# EAGLE design LM339 (EAGLE 9.6.2)
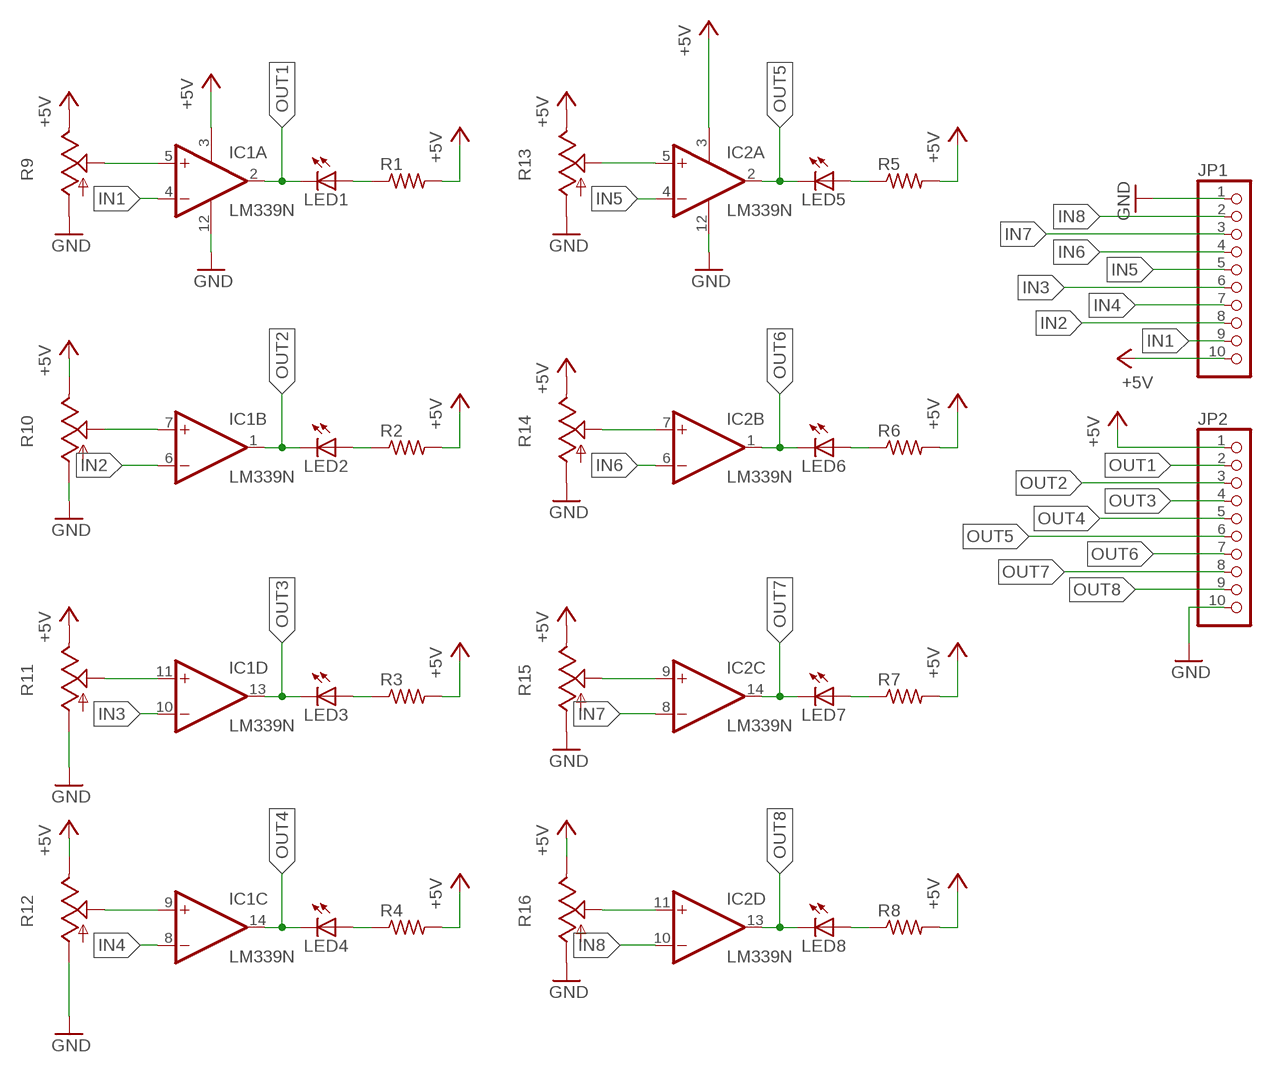
[diagram p0: schematic, sheet 1]

## Parts
IC1  LM339N  [DIL14]
IC2  LM339N  [DIL14]
JP1  PINHD-1X10  [1X10]
JP2  PINHD-1X10  [1X10]
LED1  LED5MM  [LED5MM]
LED2  LED5MM  [LED5MM]
LED3  LED5MM  [LED5MM]
LED4  LED5MM  [LED5MM]
LED5  LED5MM  [LED5MM]
LED6  LED5MM  [LED5MM]
LED7  LED5MM  [LED5MM]
LED8  LED5MM  [LED5MM]
R1  R-US_0204/7  [0204/7]
R2  R-US_0204/7  [0204/7]
R3  R-US_0204/7  [0204/7]
R4  R-US_0204/7  [0204/7]
R5  R-US_0204/7  [0204/7]
R6  R-US_0204/7  [0204/7]
R7  R-US_0204/7  [0204/7]
R8  R-US_0204/7  [0204/7]
R9  TRIM_US-B25P  [B25P]
R10  TRIM_US-B25P  [B25P]
R11  TRIM_US-B25P  [B25P]
R12  TRIM_US-B25P  [B25P]
R13  TRIM_US-B25P  [B25P]
R14  TRIM_US-B25P  [B25P]
R15  TRIM_US-B25P  [B25P]
R16  TRIM_US-B25P  [B25P]

## Nets
+5V: IC1.3(P:V+) IC2.3(P:V+) JP1.10 JP2.1 R1.2 R2.2 R3.2 R4.2 R5.2 R6.2 R7.2 R8.2 R9.E R10.E R11.E R12.E R13.E R14.E R15.E R16.E
GND: IC1.12(P:GND) IC2.12(P:GND) JP1.1 JP2.10 R9.A R10.A R11.A R12.A R13.A R14.A R15.A R16.A
IN1: IC1.4(A:-IN) JP1.9
IN2: IC1.6(B:-IN) JP1.8
IN3: IC1.10(D:-IN) JP1.6
IN4: IC1.8(C:-IN) JP1.7
IN5: IC2.4(A:-IN) JP1.5
IN6: IC2.6(B:-IN) JP1.4
IN7: IC2.8(C:-IN) JP1.3
IN8: IC2.10(D:-IN) JP1.2
N$1: LED2.A R2.1
N$2: LED1.A R1.1
N$3: LED3.A R3.1
N$4: LED4.A R4.1
N$5: LED5.A R5.1
N$6: LED6.A R6.1
N$7: LED7.A R7.1
N$8: LED8.A R8.1
N$9: IC1.11(D:+IN) R11.S
N$10: IC1.5(A:+IN) R9.S
N$11: IC1.7(B:+IN) R10.S
N$12: IC1.9(C:+IN) R12.S
N$13: IC2.9(C:+IN) R15.S
N$14: IC2.5(A:+IN) R13.S
N$15: IC2.7(B:+IN) R14.S
N$24: IC2.11(D:+IN) R16.S
OUT1: IC1.2(A:OUT) JP2.2 LED1.K(C)
OUT2: IC1.1(B:OUT) JP2.3 LED2.K(C)
OUT3: IC1.13(D:OUT) JP2.4 LED3.K(C)
OUT4: IC1.14(C:OUT) JP2.5 LED4.K(C)
OUT5: IC2.2(A:OUT) JP2.6 LED5.K(C)
OUT6: IC2.1(B:OUT) JP2.7 LED6.K(C)
OUT7: IC2.14(C:OUT) JP2.8 LED7.K(C)
OUT8: IC2.13(D:OUT) JP2.9 LED8.K(C)

## Library data of the parts
IC1 IC2 = linear:LM339: Low Power Low Offset Voltage Quad Comparators with open collector; LM139/LM239/LM339/LM2901/LM3302
JP1 JP2 = pinhead:PINHD-1X10: PIN HEADER
LED1-LED8 = led:LED: LED OSRAM: - CHIPLED LG R971, LG N971, LY N971, LG Q971, LY Q971, LO R971, LY R971 LH N974, LH R974 LS Q976, LO Q976, LY Q976 LO Q996 - Hyper CHIPLED LW Q18S LB Q993, LB Q99A, LB R99A - SideLED LS A670, LO A670, LY A670, LG A670, LP A670 LB A673, LV A673, LT A673, LW A673 LH A674 LY A675 LS A676, LA A676, LO A676, LY A676, LW A676 LS A679, LY A679, LG A679 - Hyper Micro SIDELED® LS Y876, LA Y876, LO Y876, LY Y876 LT Y87S - SmartLED LW L88C, LW L88S LB L89C, LB L89S, LG L890 LS L89K, LO L89K, LY L89K LS L896, LA L896, LO L896, LY L896 - TOPLED LS T670, LO T670, LY T670, LG T670, LP T670 LSG T670, LSP T670, LSY T670, LOP T670, LYG T670 LG T671, LOG T671, LSG T671 LB T673, LV T673, LT T673, LW T673 LH T674 LS T676, LA T676, LO T676, LY T676, LB T676, LH T676, LSB T676, LW T676 LB T67C, LV T67C, LT T67C, LS T67K, LO T67K, LY T67K, LW E67C LS E67B, LA E67B, LO E67B, LY E67B, LB E67C, LV E67C, LT E67C LW T67C LS T679, LY T679, LG T679 LS T770, LO T770, LY T770, LG T770, LP T770 LB T773, LV T773, LT T773, LW T773 LH T774 LS E675, LA E675, LY E675, LS T675 LS T776, LA T776, LO T776, LY T776, LB T776 LHGB T686 LT T68C, LB T68C - Hyper Mini TOPLED® LB M676 - Mini TOPLED Santana® LG M470 LS M47K, LO M47K, LY M47K Source: http://www.osram.convergy.de LUXEON: - LUMILED® LXK2-PW12-R00, LXK2-PW12-S00, LXK2-PW14-U00, LXK2-PW14-V00 LXK2-PM12-R00, LXK2-PM12-S00, LXK2-PM14-U00 LXK2-PE12-Q00, LXK2-PE12-R00, LXK2-PE12-S00, LXK2-PE14-T00, LXK2-PE14-U00 LXK2-PB12-K00, LXK2-PB12-L00, LXK2-PB12-M00, LXK2-PB14-N00, LXK2-PB14-P00, LXK2-PB14-Q00 LXK2-PR12-L00, LXK2-PR12-M00, LXK2-PR14-Q00, LXK2-PR14-R00 LXK2-PD12-Q00, LXK2-PD12-R00, LXK2-PD12-S00 LXK2-PH12-R00, LXK2-PH12-S00 LXK2-PL12-P00, LXK2-PL12-Q00, LXK2-PL12-R00 Source: www.luxeon.com KINGBRIGHT: KA-3528ASYC Source: www.kingbright.com
R1-R8 = rcl:R-US_: RESISTOR, American symbol; SPICEPREFIX: R
R9-R16 = pot:TRIM_US-: POTENTIOMETER

## Board
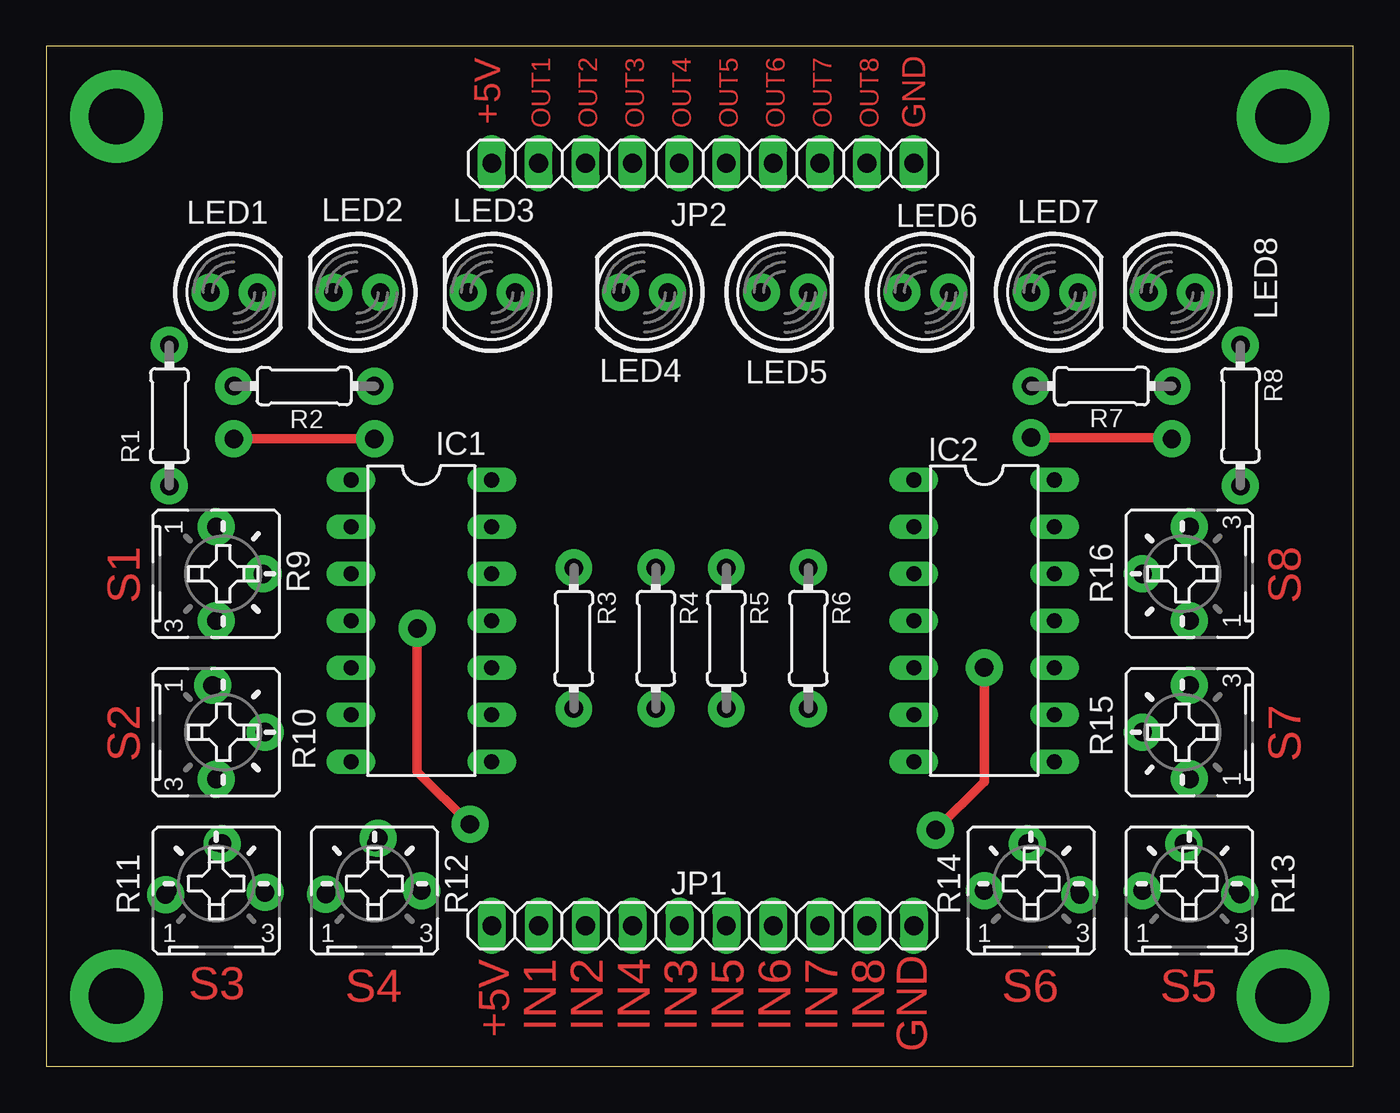
[diagram p1: board, top side]
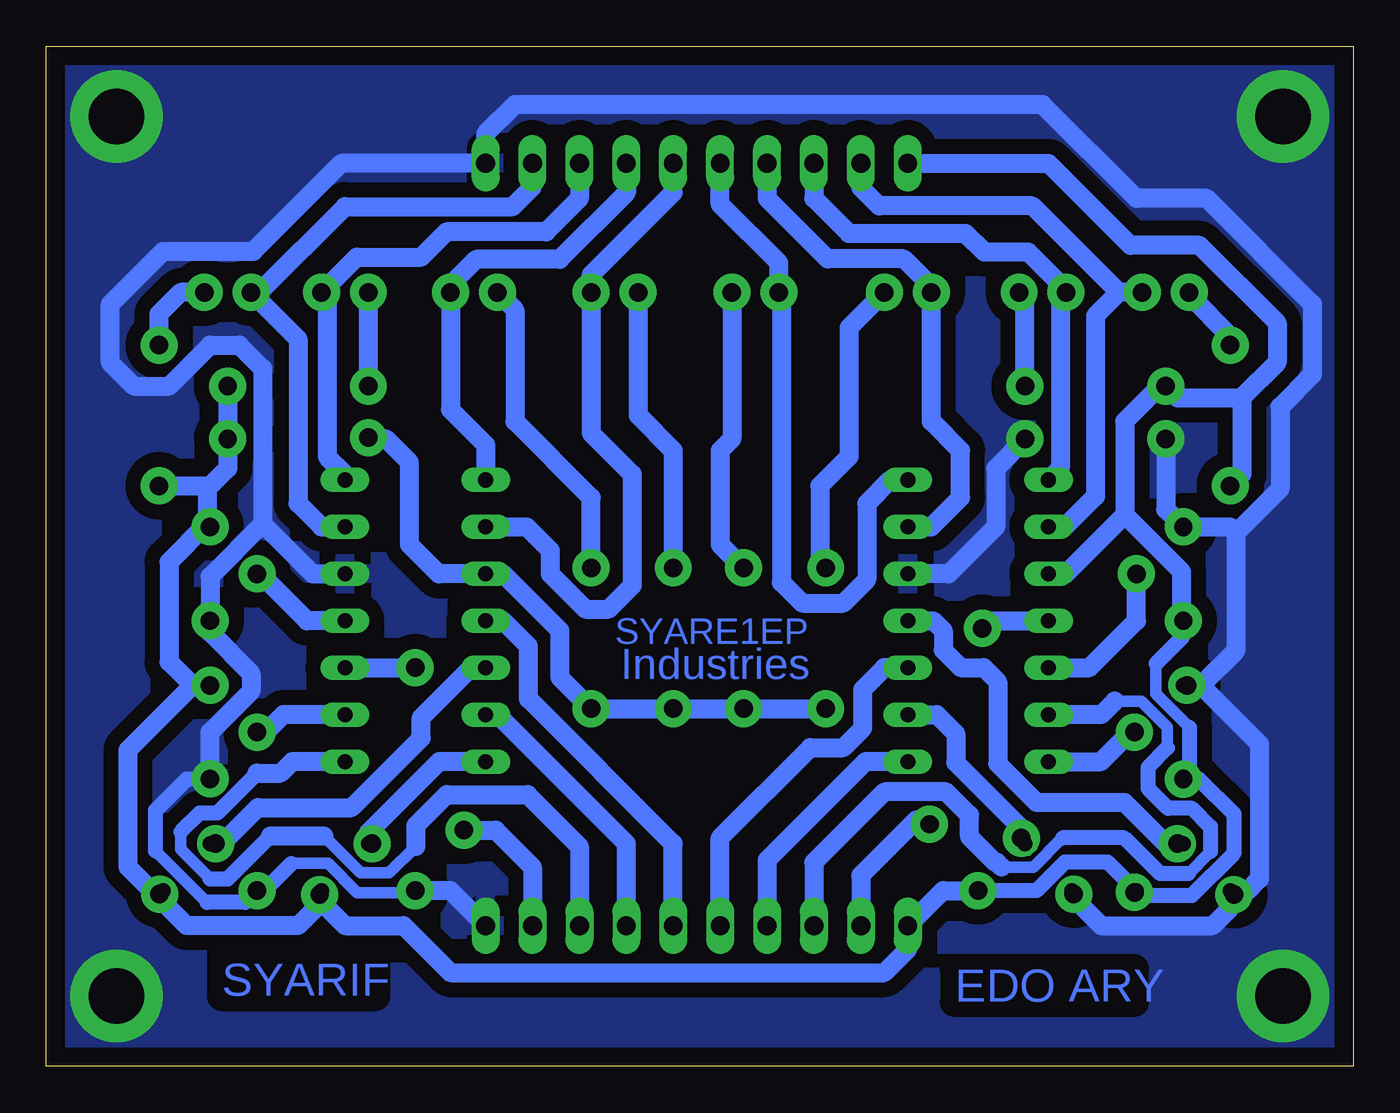
[diagram p2: board, bottom side, seen from below]

Size 70.79 x 55.23 mm. Coordinates in mm from the lower left corner, seen from the top.
Outline: 0,0 70.79,0 70.79,55.23 0,55.23 0,0
Copper layers (1*16): Top 0.035mm / dielectric 1.5mm / Bottom 0.035mm
Design rules "default": minimum track width 6mil, minimum drill 0.35mm, track to track 6mil, track to pad 6mil, pad to pad 6mil, via to via 6mil, smd to smd 6mil, copper to edge 40mil, drill to drill 6mil, minimum pad ring 10mil, minimum via ring 8mil, stop-mask expansion 4mil, vias tented up to drill 0mil, thermal gap 10mil

### Footprints (pad centres in the part's own frame; a part is rotated, then mirrored left to right if it is on the bottom)
DIL14 = drill 0.813 long: 1 -7.62,-3.81; 2 -5.08,-3.81; 3 -2.54,-3.81; 4 0,-3.81; 5 2.54,-3.81; 6 5.08,-3.81; 7 7.62,-3.81; 8 7.62,3.81; 9 5.08,3.81; 10 2.54,3.81; 11 0,3.81; 12 -2.54,3.81; 13 -5.08,3.81; 14 -7.62,3.81
1X10 = drill 1.016 long: 1 -11.43,0; 2 -8.89,0; 3 -6.35,0; 4 -3.81,0; 5 -1.27,0; 6 1.27,0; 7 3.81,0; 8 6.35,0; 9 8.89,0; 10 11.43,0
LED5MM = drill 0.813 octagon: A -1.27,0; K 1.27,0
0204/7 = drill 0.813 octagon: 1 -3.81,0; 2 3.81,0
B25P = drill 0.813 octagon: A -2.54,0; E 2.54,0; S 0,2.54

### Placement (x,y rotation side)
IC1  20.32,24.13 270 top
IC2  50.8,24.13 270 top
JP1  35.56,7.62 180 top
JP2  35.56,48.9 0 top
LED1  10.16,41.91 0 top
LED2  16.83,41.91 180 top
LED3  24.13,41.91 180 top
LED4  32.38,41.91 180 top
LED5  40.01,41.91 0 top
LED6  47.62,41.91 0 top
LED7  54.61,41.91 0 top
LED8  60.96,41.91 180 top
R1  6.67,35.24 270 top
R2  13.97,36.83 180 top
R3  28.57,23.18 270 top
R4  33.02,23.18 270 top
R5  36.83,23.18 270 top
R6  41.27,23.18 270 top
R7  57.15,36.83 0 top
R8  64.67,35.24 270 top
R9  9.21,26.67 270 top
R10  9.21,18.1 270 top
R11  9.21,9.53 0 top
R12  17.78,9.53 0 top
R13  61.91,9.53 0 top
R14  53.34,9.53 0 top
R15  61.91,18.1 90 top
R16  61.91,26.67 90 top

### Tracks (layer width: path | path; a pad name or v marks a point on that pad's centre or on a via)
+5V  (via drill 1 pad 2)
  Top 0.508: v53.34,34.04 60.89,34.04 v60.96,33.97
  Bottom 0.61: 8.88,18.36 10.69,20.18 10.69,21.81
  Bottom 0.813: R12.E 17.16,9.53 15.63,11.06 13.3,11.06 11.76,9.53 R11.E 11.49,9.26 8.74,9.26 6.46,11.55 6.46,13.66 8.36,15.56 R10.E 8.88,15.89 8.88,18.36 | R9.E 9.21,23.3 10.69,21.81
  Bottom 1.016: 15.88,26.67 IC1.3 15.57,26.67 12.38,29.86 | JP2.1 16.51,48.9 12.06,44.45 8.33,44.45 4.13,40.25 4.13,38.1 6.03,36.2 | 46.67,26.67 IC2.3 | R3.2 R4.2 R5.2 R6.2 42.98,21.07 42.98,23.61 46.04,26.67 IC2.3 | IC2.3 49.53,26.67 51.12,28.26 51.12,32.7 52.39,33.97 53.27,33.97 v53.34,34.04 | R7.2 v60.96,33.97 60.96,32.38 62.07,31.27 | 62.07,29.37 64.14,27.3 64.14,21.91 62.87,20.64 | 62.87,20.64 R15.E | 62.87,20.64 66.36,17.14 66.36,10.79 65.09,9.53 R13.E 64.45,8.89 63.18,7.62 57.15,7.62 55.88,8.89 | R8.2 62.07,31.43 62.07,31.27 | R12.E 22.23,9.53 JP1.10 24.13,6.35 25.4,5.08 48.9,5.08 51.44,7.62 54.61,7.62 55.88,8.89 | R9.E 9.29,24.21 9.29,26.77 12.38,29.86 | R14.E 55.88,8.89 | 12.38,29.86 12.38,34.92 10.48,36.83 R2.2 9.53,36.2 6.03,36.2 | 6.03,36.2 6.03,32.07 R1.2 | 62.07,31.27 62.07,29.37 | 62.07,29.37 R16.E
GND  (via drill 1 pad 2, 3 pad 5)
  Top 0.508: v10.16,33.97 v17.78,33.97
  Bottom 0.61: 62.09,8.89 64.86,11.66 | 50.92,9.41 53.94,9.41 55.53,11 57.5,11
  Bottom 0.813: R14.A 50.92,9.41 | R15.A 63.18,15.56 64.86,13.88 64.86,11.66 | 62.09,8.89 60.01,8.89 R13.A 58.97,9.53 57.5,11
  Bottom 1.016: 55.24,26.67 IC2.12 56.35,26.67 59.05,29.38 | v17.78,33.97 19.37,32.38 19.37,29.21 21.91,26.67 IC1.12 | 59.05,29.38 59.05,37.78 60.33,39.05 61.91,39.05 64.14,36.83 66.04,36.83 67.31,38.1 67.31,41.27 64.45,44.13 59.58,44.13 54.81,48.9 JP2.10 46.99,50.48 45.4,52.07 16.83,52.07 11.75,46.99 7.94,46.99 2.22,41.27 2.22,37.47 3.97,35.72 3.97,31.27 6.35,28.89 | 59.05,29.38 61.91,26.52 R16.A 61.91,23.5 59.69,21.27 59.69,20.32 61.91,18.1 v61.91,15.57 R15.A | JP1.1 48.9,9.53 R14.A | R12.A 15.24,9.21 13.65,7.62 7.62,7.62 6.67,8.57 R11.A 5.71,9.53 5.08,10.16 5.08,17.46 8.26,20.64 | 8.26,20.64 R10.A | 8.26,20.64 6.35,22.54 6.35,28.89 | v10.16,33.97 10.16,30.16 R9.A 6.67,29.21 6.35,28.89
  other vias: 3.81,51.44 66.99,51.44 66.99,3.81 3.81,3.81
  pour Bottom (isolate 0.813): -8.89,57.95 74.3,57.95 74.3,-3.81 -8.89,-3.81
IN1  (via drill 1 pad 2)
  Top 0.508: v22.95,13.11 20.1,15.97 v20.1,23.72
  Bottom 1.016: v22.95,13.11 22.73,13.34 23.68,13.34 26.67,10.35 JP1.9 | v20.1,23.72 19.68,24.13 IC1.4
IN2
  Bottom 0.61: 15.75,12.38 17.34,10.79 19.05,10.79 | 10.06,17.25 10.06,18.37 11.47,19.79 12.92,19.79 | 7.74,11.63 8.92,10.45
  Bottom 0.813: 8.92,10.45 10.46,10.45 12.4,12.38 15.75,12.38 | 7.74,11.63 7.74,12.98 8.72,13.97 10.04,13.97 11.11,15.04 11.11,16.19 10.06,17.25
  Bottom 1.016: 19.05,10.79 19.33,11.07 19.43,11.07 20.79,12.44 20.79,13.61 22.06,14.87 25.39,14.87 29.21,11.05 JP1.8 | 12.92,19.79 13.65,19.05 IC1.6
IN3
  Bottom 1.016: 24.39,21.59 IC1.10 25.4,21.59 26.57,20.42 26.57,18.32 27.62,17.26 29.41,17.26 34.29,12.38 JP1.6
IN4
  Bottom 1.016: IC1.8 26.41,16.51 31.75,11.17 JP1.7
IN5
  Bottom 1.016: JP1.5 36.83,12.06 44.67,19.9 44.67,22.76 46.04,24.13 IC2.4
IN6
  Bottom 1.016: 39.37,6.99 JP1.4 39.37,12.06 46.35,19.05 IC2.6
IN7
  Bottom 0.61: 55.74,12.46 53.76,10.48 52.2,10.48 50.78,11.91 | 63.5,12.7 63.5,11.75 61.91,10.16
  Bottom 0.813: 61.91,10.16 60.96,10.16 58.66,12.46 | 59.37,15.88 61.53,13.72 62.48,13.72 63.5,12.7
  Bottom 1.016: IC2.8 57.47,16.51 58.1,15.88 59.37,15.88 | 50.78,11.91 50.78,13.04 49.1,14.71 44.72,14.71 41.91,11.91 JP1.3 | 55.74,12.46 58.66,12.46
IN8  (via drill 1 pad 2)
  Top 0.508: v48.17,12.8 50.8,15.43 v50.8,21.59
  Bottom 1.016: 55.24,21.59 IC2.10 v50.8,21.59 | v48.17,12.8 46.45,12.8 44.45,10.79 JP1.2
N$1
  Bottom 1.016: R2.1 17.78,41.59 LED2.A
N$2
  Bottom 1.016: LED1.A 8.89,41.74 6.67,39.52 R1.1
N$3
  Bottom 1.016: LED3.A 27.3,40.01 27.3,33.02 28.89,31.43 28.89,27.3 R3.1
N$4
  Bottom 1.016: LED4.A 33.66,33.97 34.29,33.34 34.29,28.26 R4.1
N$5
  Bottom 1.016: LED5.A 38.73,35.24 36.83,33.34 R5.1
N$6
  Bottom 1.016: R6.1 41.27,30.8 45.4,34.92 45.4,40.96 LED6.A
N$7
  Bottom 1.016: R7.1 LED7.A
N$8
  Bottom 1.016: R8.1 64.67,40.74 63.5,41.91 LED8.A
N$9
  Bottom 1.016: IC1.11 22.74,24.13 22.21,23.59 22.21,22.54 21.25,21.59 20.02,21.59 19.25,20.82 19.25,16.39 17.14,14.29 12.38,14.29 10.16,12.06 R11.S
N$10  (via drill 1 pad 2)
  Bottom 1.016: IC1.5 14.29,21.59 11.75,24.13 R9.S
  other vias: 11.75,26.67
N$11
  Bottom 1.016: IC1.7 13.67,16.51 12.08,18.1 R10.S
N$12
  Bottom 1.016: 23.81,19.05 IC1.9 22.56,19.05 21.53,18.02 21.53,16.45 17.78,12.7 R12.S
N$13
  Bottom 1.016: IC2.9 57.94,19.05 58.9,18.1 R15.S
N$14
  Bottom 1.016: IC2.5 47.78,21.59 50.48,18.89 50.48,17.78 54.25,14.01 59.33,14.01 61.28,12.06 R13.S
N$15
  Bottom 1.016: IC2.7 49.5,16.51 53.34,12.67 R14.S
N$16  (via drill 1 pad 2)
  other vias: 6.67,39.05
N$17  (via drill 1 pad 2)
  other vias: 10.16,36.83
N$18  (via drill 1 pad 2)
  other vias: 11.43,41.91
N$19  (via drill 1 pad 2)
  other vias: 15.56,41.91
N$20  (via drill 1 pad 2)
  other vias: 25.4,41.91
N$21  (via drill 1 pad 2)
  other vias: 31.11,41.91
N$22  (via drill 1 pad 2)
  other vias: 41.27,26.99
N$23  (via drill 1 pad 2)
  other vias: 33.66,41.91
N$24
  Bottom 1.016: IC2.11 56.66,24.13 59.2,26.67 R16.S
N$25  (via drill 1 pad 2)
  other vias: 38.73,41.91
N$26  (via drill 1 pad 2)
  other vias: 41.27,41.91
N$27  (via drill 1 pad 2)
  other vias: 17.78,36.83
N$28  (via drill 1 pad 2)
  other vias: 48.9,41.91
N$29  (via drill 1 pad 2)
  other vias: 53.34,41.91
N$30  (via drill 1 pad 2)
  other vias: 55.88,41.91
N$31  (via drill 1 pad 2)
  other vias: 53.34,36.83
N$32  (via drill 1 pad 2)
  other vias: 60.96,36.83
N$33  (via drill 1 pad 2)
  other vias: 64.67,31.43
N$34  (via drill 1 pad 2)
  other vias: 62.23,41.91
N$35  (via drill 1 pad 2)
  other vias: 64.67,39.05
N$36  (via drill 1 pad 2)
  other vias: 59.69,41.91
N$37  (via drill 1 pad 2)
  other vias: 8.89,41.91
N$38  (via drill 1 pad 2)
  other vias: 33.02,19.37
N$39  (via drill 1 pad 2)
  other vias: 36.83,19.37
N$40  (via drill 1 pad 2)
  other vias: 41.27,19.37
N$41  (via drill 1 pad 2)
  other vias: 18.1,41.91
N$42  (via drill 1 pad 2)
  other vias: 22.86,41.91
N$43  (via drill 1 pad 2)
  other vias: 46.35,41.91
N$44  (via drill 1 pad 2)
  other vias: 59.37,26.67
N$45  (via drill 1 pad 2)
  other vias: 61.91,29.21
N$46  (via drill 1 pad 2)
  other vias: 61.91,24.13
N$47  (via drill 1 pad 2)
  other vias: 61.91,20.64
N$48  (via drill 1 pad 2)
  other vias: 59.37,18.1
N$49  (via drill 1 pad 2)
  other vias: 61.61,12.06
N$50  (via drill 1 pad 2)
  other vias: 59.37,9.53
N$51  (via drill 1 pad 2)
  other vias: 64.65,9.32
N$52  (via drill 1 pad 2)
  other vias: 55.98,9.31
N$53  (via drill 1 pad 2)
  other vias: 53.14,12.06
N$54  (via drill 1 pad 2)
  other vias: 50.8,9.53
N$55  (via drill 1 pad 2)
  other vias: 20.32,9.53
N$56  (via drill 1 pad 2)
  other vias: 17.98,12.37
N$57  (via drill 1 pad 2)
  other vias: 15.14,9.32
N$58  (via drill 1 pad 2)
  other vias: 11.85,9.43
N$59  (via drill 1 pad 2)
  other vias: 9.53,12.06
N$60  (via drill 1 pad 2)
  other vias: 6.47,9.31
N$61  (via drill 1 pad 2)
  other vias: 9.21,15.56
N$62  (via drill 1 pad 2)
  other vias: 11.85,18.1
N$63  (via drill 1 pad 2)
  other vias: 9.01,20.64
N$64  (via drill 1 pad 2)
  other vias: 9.21,24.13
N$65  (via drill 1 pad 2)
  other vias: 9.21,29.21
N$66  (via drill 1 pad 2)
  other vias: 6.67,31.43
N$67  (via drill 1 pad 2)
  other vias: 28.57,26.99
N$68  (via drill 1 pad 2)
  other vias: 36.83,26.99
N$69  (via drill 1 pad 2)
  other vias: 28.57,19.37
N$70  (via drill 1 pad 2)
  other vias: 33.02,26.99
OUT1
  Bottom 1.016: 12.7,41.91 13.97,40.64 13.97,30.87 15.63,29.21 IC1.2 | JP2.2 26.67,47.58 25.69,46.59 17.39,46.59 12.7,41.91 | LED1.K 12.7,41.91
OUT2
  Bottom 1.016: JP2.3 29.21,46.99 27.32,45.1 21,45.1 19.99,44.1 17.61,44.1 15.56,42.04 LED2.K 15.88,41.59 15.88,32.38 IC1.1
OUT3
  Bottom 1.016: JP2.4 31.75,46.99 28.48,43.72 24.35,43.72 22.86,42.23 LED3.K 22.86,34.92 21.27,33.34 21.27,30.8 22.86,29.21 IC1.13
OUT4
  Bottom 1.016: JP2.5 34.29,46.67 31.11,43.5 LED4.K 30.98,41.77 30.98,26.21 29.84,25.08 27.62,25.08 26.35,26.35 26.35,30.48 25.08,31.75 IC1.14
OUT5
  Bottom 1.016: 46.29,29.21 IC2.2 44.77,29.21 43.5,27.94 43.5,26.67 41.59,24.77 40.32,24.77 39.05,26.04 39.05,32.07 41.27,34.29 LED5.K 41.27,42.86 36.83,47.31 JP2.6
OUT6
  Bottom 1.016: JP2.7 39.37,47.31 42.98,43.7 47.51,43.7 48.9,42.31 LED6.K 48.9,35.56 46.99,33.66 IC2.1
OUT7
  Bottom 1.016: JP2.8 41.91,46.99 43.72,45.19 49.11,45.19 50.48,43.81 53.98,43.81 LED7.K 55.56,41.59 55.56,33.02 54.61,32.07 IC2.14
OUT8
  Bottom 1.016: JP2.9 44.45,47.62 45.52,46.55 54.61,46.55 59.26,41.91 LED8.K 57.15,39.37 57.15,30.48 55.88,29.21 IC2.13

### Text on the board
Top: +5V | OUT1 | OUT2 | OUT3 | OUT4 | OUT5 | OUT6 | OUT7 | OUT8 | GND | S1 | S8 | S2 | S7 | GND | S3 | S4 | S6 | S5 | +5V | IN1 | IN2 | IN4 | IN3 | IN5 | IN6 | IN7 | IN8
Bottom: SYARE1EP | Industries | SYARIF | EDO ARY